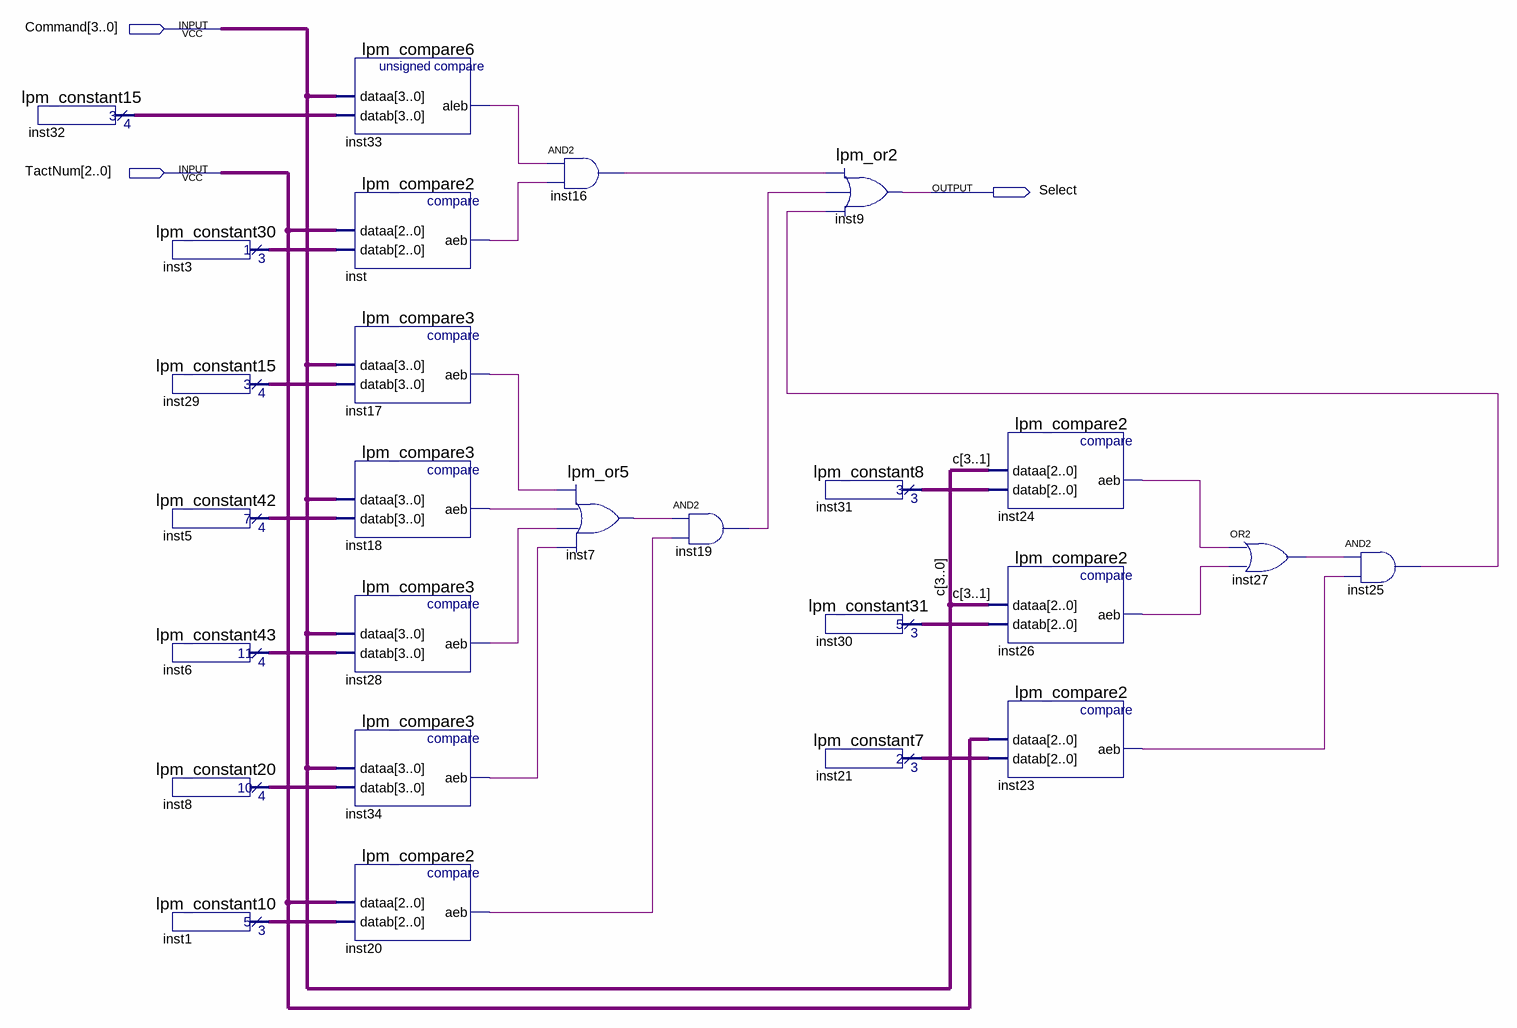
[diagram p0: schematic sheet]
// Quartus schematic SelectGRAddress.bdf as structural Verilog: 26 symbols, 3 pins
module SelectGRAddress (
  input  [3:0] Command,
  input  [2:0] TactNum,
  output Select
);

  wire inst7_result, inst16_out, inst17_aeb, inst18_aeb, inst19_out, inst20_aeb, inst23_aeb, inst24_aeb,
       inst25_out, inst26_aeb, inst27_out, inst28_aeb, inst33_aleb, inst34_aeb, inst_aeb;
  wire [2:0] inst1_result, inst3_result, inst21_result, inst30_result, inst31_result;
  wire [3:0] inst5_result, inst6_result, inst8_result, inst29_result, inst32_result;

  lpm_constant15 inst32 (.result(inst32_result));
  lpm_constant30 inst3 (.result(inst3_result));
  lpm_constant15 inst29 (.result(inst29_result));
  lpm_constant42 inst5 (.result(inst5_result));
  lpm_constant43 inst6 (.result(inst6_result));
  lpm_constant20 inst8 (.result(inst8_result));
  lpm_constant10 inst1 (.result(inst1_result));
  lpm_compare6 inst33 (.dataa(Command), .datab(inst32_result), .aleb(inst33_aleb));
  lpm_compare2 inst (.dataa(TactNum), .datab(inst3_result), .aeb(inst_aeb));
  lpm_compare3 inst17 (.dataa(Command), .datab(inst29_result), .aeb(inst17_aeb));
  lpm_compare3 inst18 (.dataa(Command), .datab(inst5_result), .aeb(inst18_aeb));
  lpm_compare3 inst28 (.dataa(Command), .datab(inst6_result), .aeb(inst28_aeb));
  lpm_compare3 inst34 (.dataa(Command), .datab(inst8_result), .aeb(inst34_aeb));
  lpm_compare2 inst20 (.dataa(TactNum), .datab(inst1_result), .aeb(inst20_aeb));
  and inst16 (inst16_out, inst33_aleb, inst_aeb);
  lpm_or5 inst7 (.data0(inst17_aeb), .data1(inst18_aeb), .data2(inst28_aeb), .data3(inst34_aeb), .result(inst7_result));
  and inst19 (inst19_out, inst7_result, inst20_aeb);
  lpm_constant8 inst31 (.result(inst31_result));
  lpm_constant31 inst30 (.result(inst30_result));
  lpm_constant7 inst21 (.result(inst21_result));
  lpm_or2 inst9 (.data0(inst16_out), .data1(inst19_out), .data2(inst25_out), .result(Select));
  lpm_compare2 inst24 (.dataa(Command[3:1]), .datab(inst31_result), .aeb(inst24_aeb));
  lpm_compare2 inst26 (.dataa(Command[3:1]), .datab(inst30_result), .aeb(inst26_aeb));
  lpm_compare2 inst23 (.dataa(TactNum), .datab(inst21_result), .aeb(inst23_aeb));
  or inst27 (inst27_out, inst24_aeb, inst26_aeb);
  and inst25 (inst25_out, inst27_out, inst23_aeb);

  // Other names for the same wires on the sheet: c[3:0] = Command
endmodule
